# EAGLE design mapleCUx_large_320-002 (EAGLE 7.6.0)
MAPLE-CUx Large Version
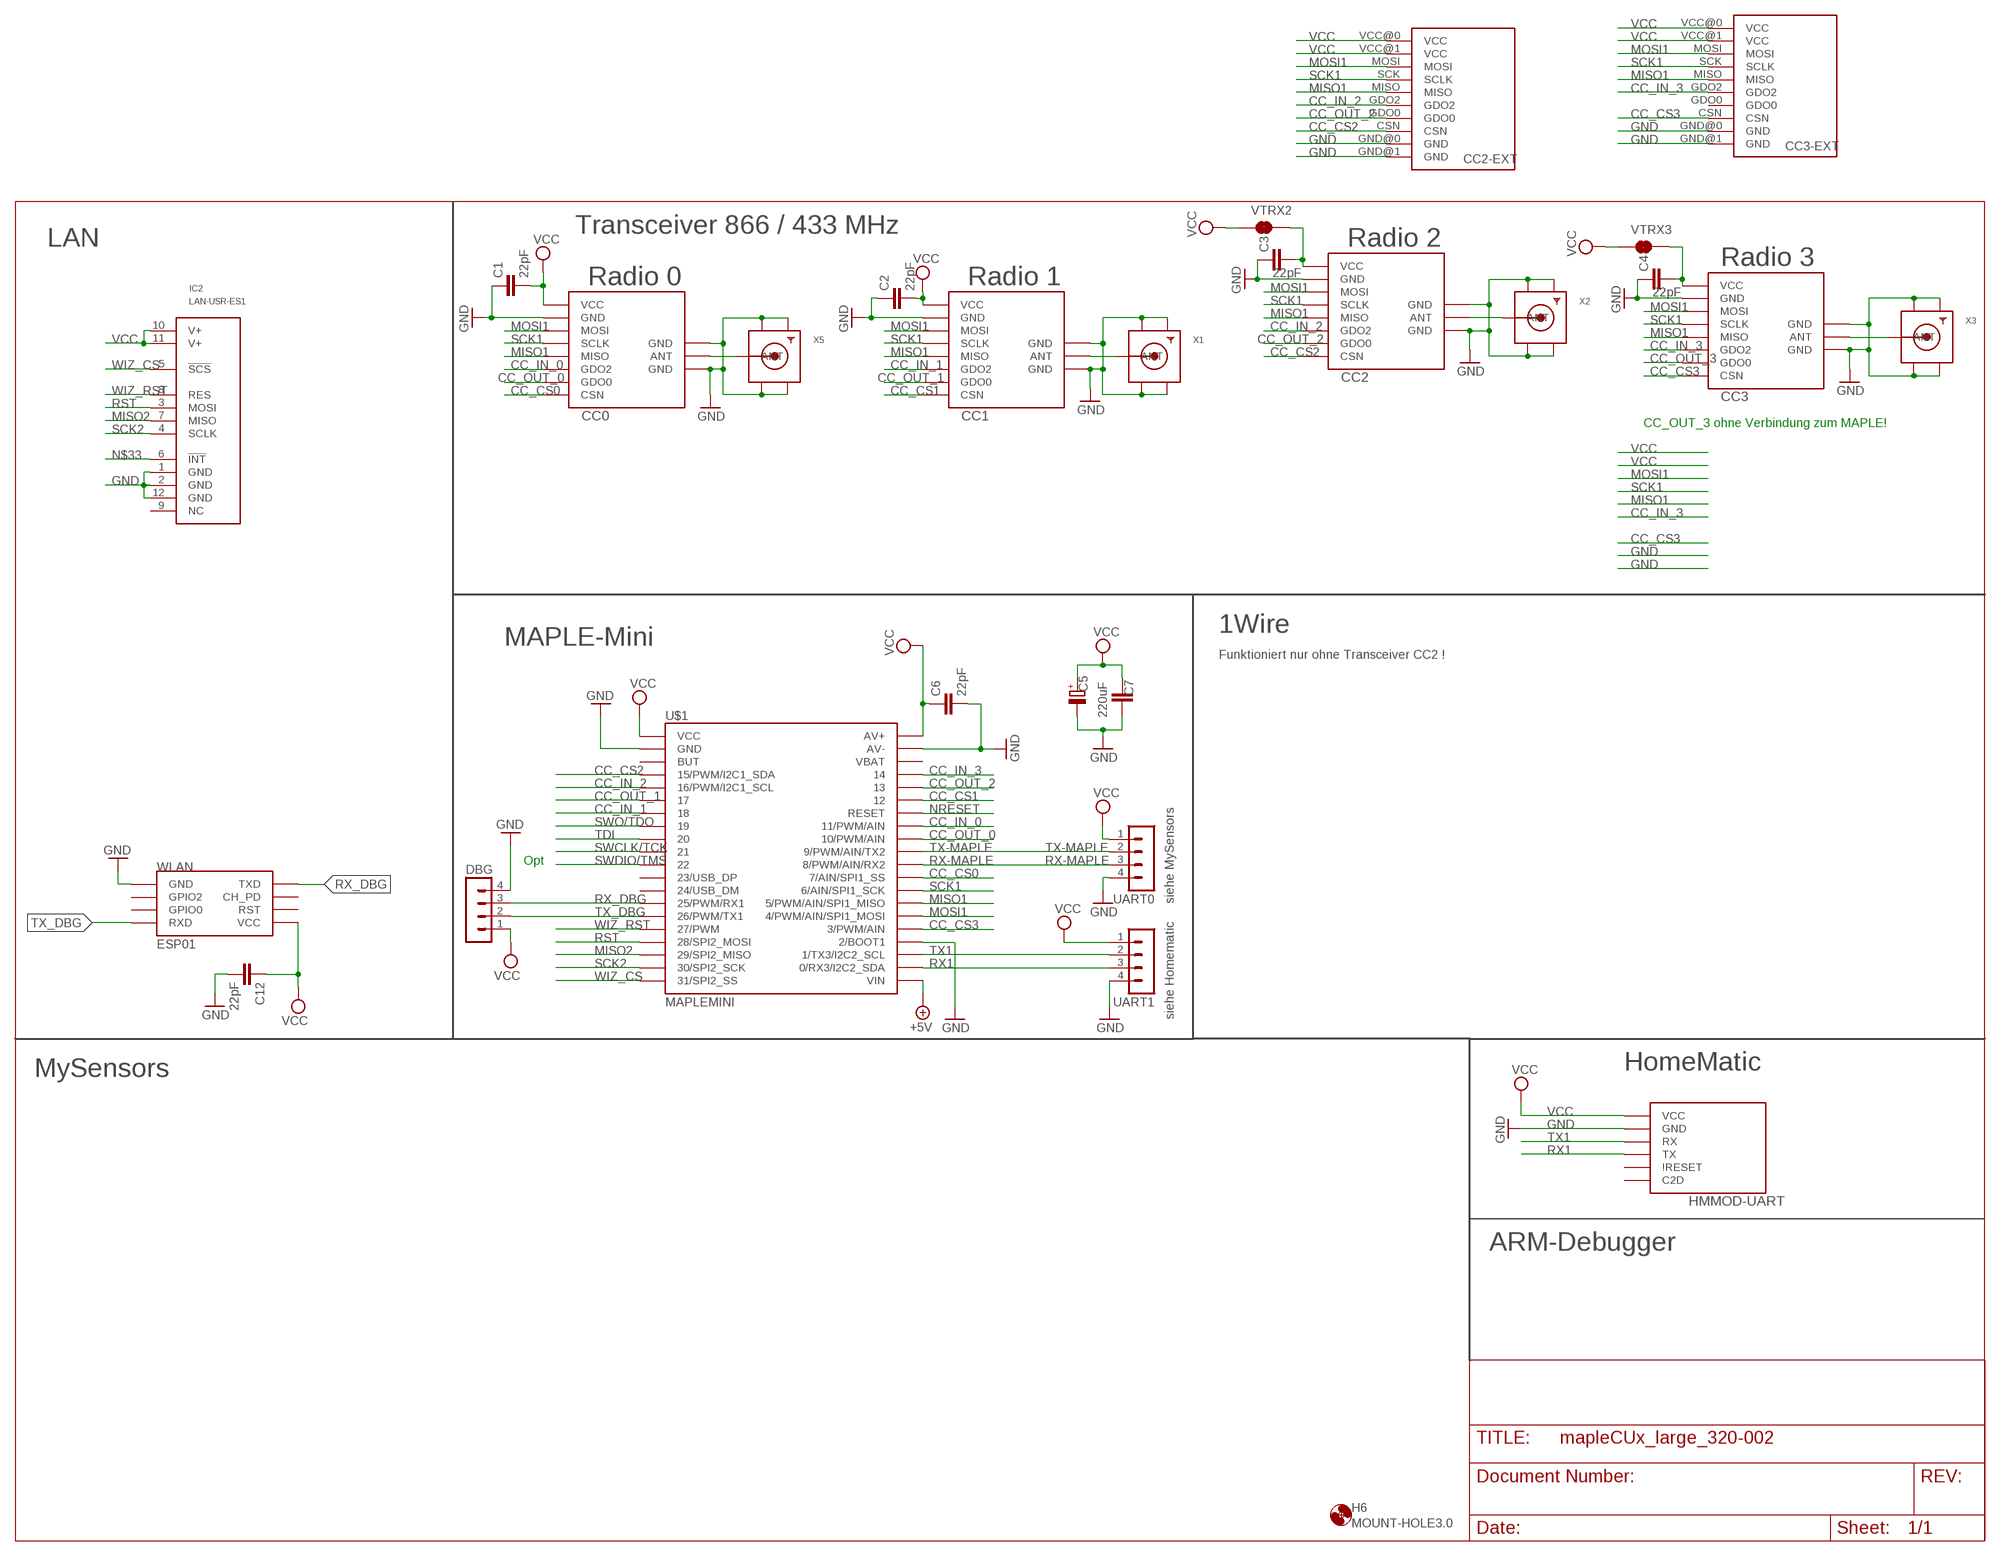
[diagram p0: schematic, sheet 1]

## Parts
C1  22pF  C-EUC0805  [C0805]
C2  22pF  C-EUC0805  [C0805]
C3  22pF  C-EUC0805  [C0805]
C4  22pF  C-EUC0805  [C0805]
C5  220uF  CPOL-EUE5-8.5  [E5-8,5]
C6  22pF  C-EUC0805  [C0805]
C7  C-EUC1812  [C1812]
C12  22pF  C-EUC0805  [C0805]
CC0  CC1101  CC1101_MODULE1SMD  [CC1101_MODULE1_SMD]
CC1  CC1101_MODULE1SMD  [CC1101_MODULE1_SMD]
CC2  CC1101_MODULE1SMD  [CC1101_MODULE1_SMD]
CC2-EXT  CC1101_MODULE3_DIL  [CC1101_MODULE3_DIL]
CC3  CC1101_MODULE1SMD  [CC1101_MODULE1_SMD]
CC3-EXT  CC1101_MODULE3_DIL  [CC1101_MODULE3_DIL]
DBG  MA04-1  [MA04-1]
H6  MOUNT-HOLE3.0  [3,0]
HMMOD-UART  HM-MOD-UARTDIL  [HM-MOD-UART-DIL]
IC2  LAN-USR-ES1  [USR-ES1]
U$1  MAPLEMINI  [20-DIP]
UART0  MA04-1  [MA04-1]
UART1  MA04-1  [MA04-1]
VTRX2  JUMPER-SMT_2_NC_TRACE_SILK  [SMT-JUMPER_2_NC_TRACE_SILK]
VTRX3  JUMPER-SMT_2_NC_TRACE_SILK  [SMT-JUMPER_2_NC_TRACE_SILK]
WLAN  ESP01  [ESP01]
X1  SMACONNECTOR_EDGE  [SMA_EDGELAUNCH]
X2  SMACONNECTOR_EDGE  [SMA_EDGELAUNCH]
X3  SMACONNECTOR_EDGE  [SMA_EDGELAUNCH]
X5  SMACONNECTOR_EDGE  [SMA_EDGELAUNCH]

## Nets
+5V [PWR]: U$1.21(VIN)
ANT0: CC0.ANT X5.P(ANT)
ANT1: CC1.ANT X1.P(ANT)
ANT2: CC2.ANT X2.P(ANT)
ANT3: CC3.ANT X3.P(ANT)
CC_CS0: CC0.CSN U$1.29(7/AIN/SPI1_SS)
CC_CS1: CC1.CSN U$1.35
CC_CS2: CC2-EXT.CSN CC2.CSN U$1.4(15/PWM/I2C1_SDA)
CC_CS3: CC3-EXT.CSN CC3.CSN U$1.25(3/PWM/AIN)
CC_IN_0: CC0.GDO2 U$1.33(11/PWM/AIN)
CC_IN_1: CC1.GDO2 U$1.7
CC_IN_2: CC2-EXT.GDO2 CC2.GDO2 U$1.5(16/PWM/I2C1_SCL)
CC_IN_3: CC3-EXT.GDO2 CC3.GDO2 U$1.37
CC_OUT_0: CC0.GDO0 U$1.32(10/PWM/AIN)
CC_OUT_1: CC1.GDO0 U$1.6
CC_OUT_2: CC2-EXT.GDO0 CC2.GDO0 U$1.36
CC_OUT_3: CC3.GDO0
GND [PWR]: C1.1 C2.1 C3.1 C4.1 C5.- C6.2 C7.1 C12.2 CC0.GND@0(GND) CC0.GND@1(GND) CC0.GND@2(GND) CC1.GND@0(GND) CC1.GND@1(GND) CC1.GND@2(GND) CC2-EXT.GND@0(GND) CC2-EXT.GND@1(GND) CC2.GND@0(GND) CC2.GND@1(GND) CC2.GND@2(GND) CC3-EXT.GND@0(GND) CC3-EXT.GND@1(GND) CC3.GND@0(GND) CC3.GND@1(GND) CC3.GND@2(GND) DBG.4 HMMOD-UART.2(GND) IC2.1(GND) IC2.2(GND) IC2.12(GND) U$1.2(GND) U$1.24(2/BOOT1) U$1.39(AV-) UART0.4 UART1.4 WLAN.GND X1.GND@1(GND4) X1.GND@2(GND3) X1.GND@3(GND2) X1.GND@4(GND1) X2.GND@1(GND4) X2.GND@2(GND3) X2.GND@3(GND2) X2.GND@4(GND1) X3.GND@1(GND4) X3.GND@2(GND3) X3.GND@3(GND2) X3.GND@4(GND1) X5.GND@1(GND4) X5.GND@2(GND3) X5.GND@3(GND2) X5.GND@4(GND1)
MISO1: CC0.MISO CC1.MISO CC2-EXT.MISO CC2.MISO CC3-EXT.MISO CC3.MISO U$1.27(5/PWM/AIN/SPI1_MISO)
MISO2: IC2.7(MISO) U$1.18(29/SPI2_MISO)
MOSI1: CC0.MOSI CC1.MOSI CC2-EXT.MOSI CC2.MOSI CC3-EXT.MOSI CC3.MOSI U$1.26(4/PWM/AIN/SPI1_MOSI)
N$1 [PWR]: C3.2 CC2.VCC VTRX2.2
N$3 [PWR]: C4.2 CC3.VCC VTRX3.2
N$33: IC2.6(!INT!)
NRESET: U$1.34(RESET)
RST: IC2.3(MOSI) U$1.17(28/SPI2_MOSI)
RX1: HMMOD-UART.5(TX) U$1.22(0/RX3/I2C2_SDA) UART1.3
RX-MAPLE: U$1.30(8/PWM/AIN/RX2) UART0.3
RX_DBG: DBG.3 U$1.14(25/PWM/RX1) WLAN.TX(TXD)
SCK1: CC0.SCLK CC1.SCLK CC2-EXT.SCK(SCLK) CC2.SCLK CC3-EXT.SCK(SCLK) CC3.SCLK U$1.28(6/AIN/SPI1_SCK)
SCK2: IC2.4(SCLK) U$1.19(30/SPI2_SCK)
SWCLK/TCK: U$1.10
SWDIO/TMS: U$1.11
SWO/TDO: U$1.8
TDI: U$1.9
TX1: HMMOD-UART.6(RX) U$1.23(1/TX3/I2C2_SCL) UART1.2
TX-MAPLE: U$1.31(9/PWM/AIN/TX2) UART0.2
TX_DBG: DBG.2 U$1.15(26/PWM/TX1) WLAN.RX(RXD)
VCC [PWR]: C1.2 C2.2 C5.+ C6.1 C7.2 C12.1 CC0.VCC CC1.VCC CC2-EXT.VCC@0(VCC) CC2-EXT.VCC@1(VCC) CC3-EXT.VCC@0(VCC) CC3-EXT.VCC@1(VCC) DBG.1 HMMOD-UART.1(VCC) IC2.10(V+) IC2.11(V+) U$1.1(VCC) U$1.40(AV+) UART0.1 UART1.1 VTRX2.1 VTRX3.1 WLAN.VCC
WIZ_CS: IC2.5(!SCS!) U$1.20(31/SPI2_SS)
WIZ_RST: IC2.8(RES) U$1.16(27/PWM)
Unconnected: CC3-EXT.GDO0 HMMOD-UART.3(C2D) HMMOD-UART.4(\!RESET) IC2.9(NC) U$1.3(BUT) U$1.12(23/USB_DP) U$1.13(24/USB_DM) U$1.38(VBAT) WLAN.CH_PD WLAN.GPIO0 WLAN.GPIO2 WLAN.RST

## Notes on the sheet
- Transceiver 866 / 433 MHz
- LAN | Radio 2
- Radio 3
- Radio 0 | Radio 1
- CC_OUT_3 ohne Verbindung zum MAPLE!
- 1Wire
- MAPLE-Mini
- Funktioniert nur ohne Transceiver CC2 !
- Opt
- siehe MySensors
- siehe Homematic
- MySensors | HomeMatic
- ARM-Debugger

## Library data of the parts
C1-C4 C6 C7 C12 = rcl:C-EU: CAPACITOR, European symbol
C5 = rcl:CPOL-EU: POLARIZED CAPACITOR, European symbol
CC0 CC1-CC3 = wireless:CC1101_MODULE1: CC1101 wireless module for 433/868 MHz (sold from Aliexpress). DIL version for mounting with pin header (and SMD soldering) and SMD only variant available.
CC2-EXT CC3-EXT = wireless:CC1101_MODULE3_DIL: 433 Mhz CC1101 wireless module named RF1101SE V3.1 package special has only limited silk screen on tPlace layer
DBG UART0 UART1 = con-lstb:MA04-1: PIN HEADER; OC_FARNELL: unknown; OC_NEWARK: unknown
H6 = holes:MOUNT-HOLE: MOUNTING HOLE with drill center marker
HMMOD-UART = wireless:HM-MOD-UART: eQ3 HM-MOD-UART-AW-SH2 wireless module for 868 MHz. DIL version for mounting with pin header (antenna upwards) and SMD variant available (antenna downwards).
IC2 = Martin-Communication:LAN-USR-ES1
U$1 = maplemini-small:MAPLEMINI
VTRX2 VTRX3 = SparkFun-Jumpers:JUMPER-SMT_2_NC_TRACE: Normally closed trace jumper This jumper has a trace between two pads so it's normally closed (NC). Use a razor knife to open the connection. For best results follow the IPC guidelines for cutting traces: Cutout at least 0.063 mm (0.005 in). Remove all loose material to clean up the cut area. Seal the cut with an approved epoxy. Reapply solder to reclose the connection.
WLAN = esp8266modules:ESP01: ESP8266 Wifi module 01
X1-X3 X5 = adafruit:SMACONNECTOR: SMA Connector 90° DIP SMA Connector, 50 Ohm (4UConnector: 07259)

## Net classes
0 default: width 0.305 mm
1 PWR: width 0.457 mm

## Board
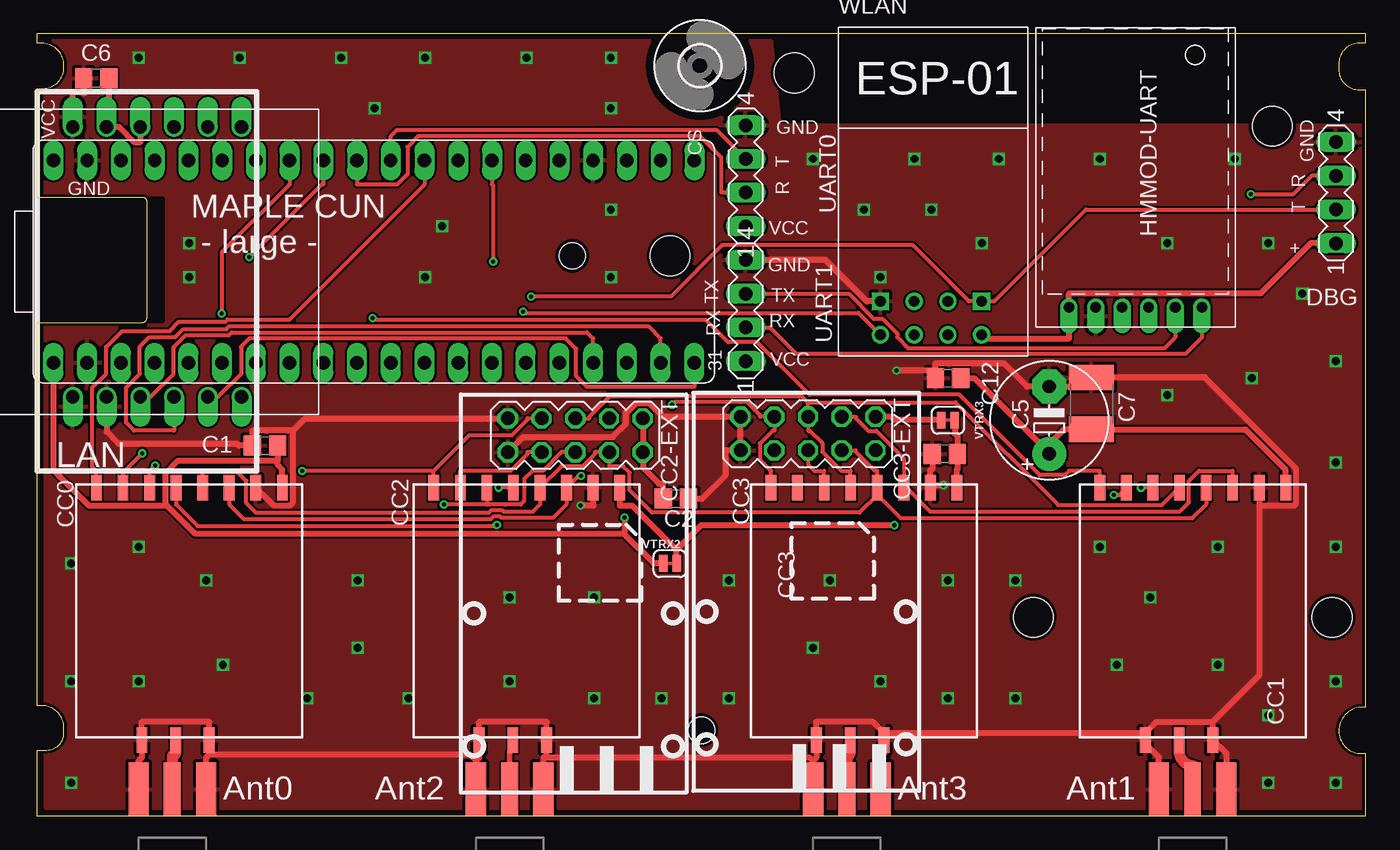
[diagram p1: board, top side]
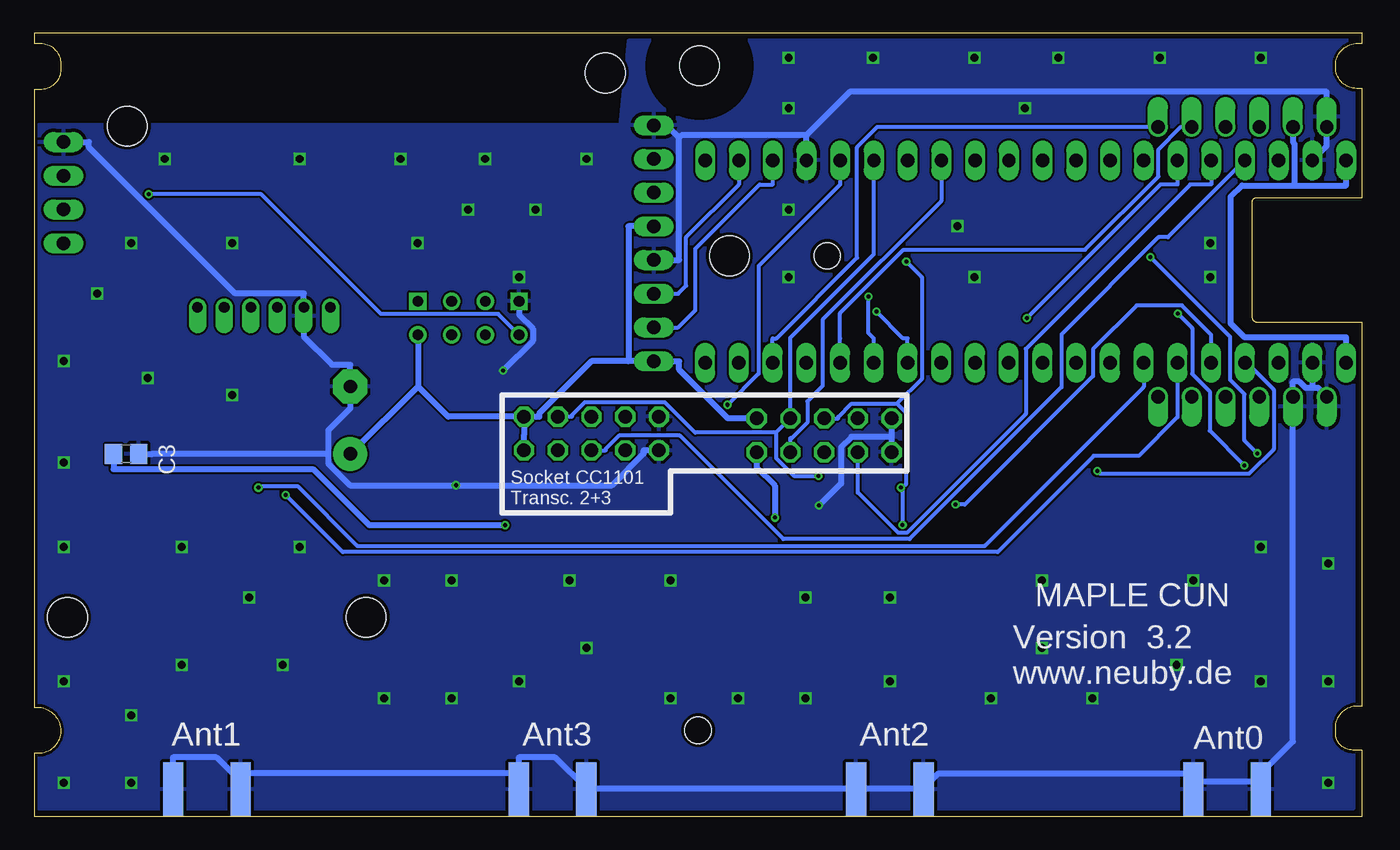
[diagram p2: board, bottom side, seen from below]

Size 100 x 59 mm. Coordinates in mm from the lower left corner, seen from the top.
Outline: 0,0 0,5 0.71,5 arc90 2,6.29 2,6.67 arc90 0.32,8.35 0,8.35 0,37.21 7.89,37.21 arc90 8.26,37.58 8.26,46.32 arc90 7.97,46.61 0,46.61 0,54.83 0.39,54.83 arc90 2,56.44 2,56.57 arc90 0.33,58.24 0,58.24 0,59 100,59 100,58.24 99.54,58.24 arc90 98,56.7 98,56.41 arc90 99.41,54.75 100,54.75 100,8.24 99.8,8.24 arc90 98,6.44 arc90 99.69,4.75 100,4.75 100,0 0,0
Copper layers (1*16): Top 0.035mm / dielectric 1.5mm / Bottom 0.035mm
Design rules "SeeedStudio_2layer_DRU_no_angle_20140221": minimum track width 6mil, minimum drill 12mil, track to track 6mil, track to pad 6mil, pad to pad 6mil, via to via 6mil, smd to smd 0mil, copper to edge 10mil, drill to drill 10mil, minimum pad ring 10mil, minimum via ring 6mil, stop-mask expansion 2mil, vias tented up to drill 100mil, thermal gap 10mil
Holes 2 mm at 50,6.5 40.28,42.23
Holes 3 mm at 47.65,42.23 93,52 57,56 75,15 97.5,15
tRestrict: area 0,37.3 to 9.4,46.5
bRestrict: area 0,37.3 to 9.4,46.5

### Footprints (pad centres in the part's own frame; a part is rotated, then mirrored left to right if it is on the bottom)
C0805 = smd 1.3 x 1.5: 1 -0.95,0; 2 0.95,0
E5-8,5 = drill 1.016 pad 2.54: + -2.54,0 | drill 1.016 pad 2.54 octagon: - 2.54,0
C1812 = smd 1.9 x 3.4: 1 -1.95,0; 2 1.95,0
CC1101_MODULE1_SMD = smd 1.93 x 0.813: ANT 19,5.96; CSN 0,0; GDO0 0,2; GDO2 0,4; GND@0 0,12; GND@1 19,8.5; GND@2 19,3.42; MISO 0,6; MOSI 0,10; SCLK 0,8; VCC 0,14
CC1101_MODULE3_DIL = drill 1.016 octagon: CSN 1.81,6.1; GDO0 4.35,6.1; GDO2 4.35,8.64; GND@0 1.81,3.56; GND@1 4.35,3.56; MISO 1.81,8.64; MOSI 1.81,11.18; SCK 4.35,11.18; VCC@0 1.81,13.72; VCC@1 4.35,13.72
MA04-1 = drill 1.016 long: 1 -3.81,0; 2 -1.27,0; 3 1.27,0; 4 3.81,0
3,0 = hole 3: 0,0
HM-MOD-UART-DIL = drill 0.8 offset: 1 0,12; 2 0,10; 3 0,8; 4 0,6; 5 0,4; 6 0,2
USR-ES1 = drill 1 pad 1.35 offset: 1 -10.16,5.715; 2 -10.16,3.175; 3 -10.16,0.635; 4 -10.16,-1.905; 5 -10.16,-4.445; 6 -10.16,-6.985; 7 10.16,-6.985; 8 10.16,-4.445; 9 10.16,-1.905; 10 10.16,0.635; 11 10.16,3.175; 12 10.16,5.715
20-DIP = drill 1.016 pad 1.27 long: 1 -24.13,-7.62; 2 -21.59,-7.62; 3 -19.05,-7.62; 4 -16.51,-7.62; 5 -13.97,-7.62; 6 -11.43,-7.62; 7 -8.89,-7.62; 8 -6.35,-7.62; 9 -3.81,-7.62; 10 -1.27,-7.62; 11 1.27,-7.62; 12 3.81,-7.62; 13 6.35,-7.62; 14 8.89,-7.62; 15 11.43,-7.62; 16 13.97,-7.62; 17 16.51,-7.62; 18 19.05,-7.62; 19 21.59,-7.62; 20 24.13,-7.62 | drill 1 pad 1.27 long: 21 24.13,7.62; 22 21.59,7.62; 23 19.05,7.62; 24 16.51,7.62; 25 13.97,7.62; 26 11.43,7.62; 27 8.89,7.62; 28 6.35,7.62; 29 3.81,7.62; 30 1.27,7.62; 31 -1.27,7.62; 32 -3.81,7.62; 33 -6.35,7.62; 34 -8.89,7.62; 35 -11.43,7.62; 36 -13.97,7.62; 37 -16.51,7.62; 38 -19.05,7.62; 39 -21.59,7.62; 40 -24.13,7.62
SMT-JUMPER_2_NC_TRACE_SILK = smd 0.635 x 1.27: 1 -0.508,0; 2 0.508,0
ESP01 = drill 0.8: CH_PD -1.285,-8.178; GPIO0 1.255,-5.638; GPIO2 -1.285,-5.638; RST 1.255,-8.178; TX -3.825,-8.178; VCC 3.795,-8.178 | drill 0.8 square: GND -3.825,-5.638; RX 3.795,-5.638
SMA_EDGELAUNCH = smd 4.064 x 1.524: GND@1 2.032,-2.54; GND@2 2.032,2.54 | smd 4.064 x 1.524 bottom: GND@3 2.032,2.54; GND@4 2.032,-2.54 | smd 4.064 x 1.27: P 2.032,0

### Placement (x,y rotation side)
C1  17.14,27.94 0 top
C2  48.08,23.95 180 top
C3  93.08,27.3 180 bottom
C4  68.33,27.3 0 top
C5  76.2,29.84 90 top
C6  4.45,55.61 180 top
C7  79.38,31.11 270 top
C12  68.58,33.02 180 top
CC0  4.45,24.77 270 top
CC1  80.01,24.77 270 top
CC2  29.84,24.77 270 top
CC2-EXT  31.87,31.79 270 top
CC3  55.24,24.77 270 top
CC3-EXT  49.4,31.93 270 top
DBG  97.79,46.99 90 top
H6  49.89,56.55 0 top
HMMOD-UART  89.69,38.35 90 top
IC2  8.38,41.78 90 top
U$1  25.34,41.8 0 top
UART0  53.34,48.26 90 top
UART1  53.34,38.1 90 top
VTRX2  47.62,19.05 0 top
VTRX3  68.58,29.84 0 top
WLAN  67.31,44.45 0 top
X1  87,0 90 top
X2  35.56,0 90 top
X3  60.96,0 90 top
X5  10.16,0 90 top

### Tracks (layer width: path | path; a pad name or v marks a point on that pad's centre or on a via)
ANT0
  Top 0.813: CC0.ANT 10.4,4.82 arc-90 10.16,4.57 X5.P
ANT1
  Top 0.813: CC1.ANT 85.97,4.96 arc90 87.12,3.81 87.12,1.02 87.12,1.91 arc90 X1.P
ANT2
  Top 0.406: CC2.ANT 35.81,5.76 35.81,5.08 35.56,4.83 X2.P | X2.P 35.56,1.27 X2.P
ANT3
  Top 0.813: CC3.ANT 61.2,4.82 arc-90 60.96,4.57 X3.P
CC_CS0
  Top 0.305: CC0.CSN 4.45,26.04 4.14,26.34 4.14,32.3 5.18,33.34 5.18,35.36 6.38,36.56 9.96,36.56 10.66,37.27 14.14,37.27 14.32,37.44 18.98,37.44 29.15,47.61 U$1.29
CC_CS1  (via drill 0.3 pad 0.61)
  Top 0.305: v25.25,37.54 25.4,37.39 50.34,37.39 52.01,35.72 54.2,35.72 58.15,31.78 69.42,31.78 75.48,25.72 77.38,25.72 77.7,26.04 80.01,26.04 CC1.CSN
  Bottom 0.305: v25.25,37.54 15.19,47.61 13.91,47.61 U$1.35
CC_CS2  (via drill 0.3 pad 0.61)
  Top 0.305: 29.84,26.04 v19.95,26.04 | CC2-EXT.CSN 36.9,29.98 36.9,29.9 35.71,28.71 32.52,28.71 29.84,26.04 | CC2.CSN 29.84,26.04
  Bottom 0.305: U$1.4 8.69,34.18 6.67,32.15 6.67,27.66 8.53,25.8 19.71,25.8 v19.95,26.04
CC_CS3  (via drill 0.3 pad 0.61)
  Top 0.305: v47.79,31.01 47.99,31.21 53.44,31.21 54.43,30.23 54.43,30.11 CC3-EXT.CSN 55.49,29.05 55.36,29.05 54.41,28.1 54.41,26.87 55.24,26.04 CC3.CSN
  Bottom 0.305: v47.79,31.01 45.45,33.35 45.45,41.46 39.31,47.61 U$1.25
CC_IN_0  (via drill 0.3 pad 0.61)
  Top 0.305: U$1.33 18.99,47.61 13.89,42.51 v13.89,37.88 | v8.87,26.44 8.46,26.04 8.45,26.04 CC0.GDO2
  Bottom 0.305: v13.89,37.88 12.8,36.79 12.8,33.34 11.48,32.02 11.48,29.06 v8.87,26.44
CC_IN_1  (via drill 0.3 pad 0.61)
  Top 0.305: CC1.GDO2 v83.11,24.77
  Bottom 0.305: v83.11,24.77 83,24.88 80.16,24.88 75.67,20.39 28.41,20.39 16.45,32.35 U$1.7
CC_IN_2  (via drill 0.3 pad 0.61)
  Top 0.305: 33.84,23.5 v30.61,23.5 | 33.84,23.5 33.97,23.5 35.23,23.5 36.39,23.5 36.66,23.77 36.66,25.42 37.28,26.04 38.07,26.04 39.44,27.4 39.44,27.44 CC2-EXT.GDO2 | CC2.GDO2 33.84,23.5
  Bottom 0.305: v30.61,23.5 29.93,23.5 20.26,33.16 20.26,35.2 16.97,38.48 13.57,38.48 11.37,36.28 11.37,36.01 U$1.5
CC_IN_3
  Top 0.305: CC3.GDO2 59.24,26.04 58.51,26.04 58.03,26.51 CC3-EXT.GDO2
  Bottom 0.305: U$1.37 14.62,43.62 15.33,43.62 22.64,36.31 22.64,32.33 34.08,20.9 43.59,20.9 51.38,28.69 55.97,28.69 56.97,27.69 56.97,27.57 CC3-EXT.GDO2
CC_OUT_0  (via drill 0.3 pad 0.61)
  Top 0.305: U$1.32 21.53,47.61 21.42,47.61 v15.95,42.14 | CC0.GDO0 6.45,26.04 6.56,26.04 v7.88,27.36
  Bottom 0.305: v7.88,27.36 8.86,28.33 8.86,31.81 9.94,32.89 9.94,36.12 v15.95,42.14
CC_OUT_1  (via drill 0.3 pad 0.61)
  Top 0.305: v81.06,24.23 81.47,24.23 CC1.GDO0
  Bottom 0.305: U$1.6 13.91,30.08 16.82,27.17 20.2,27.17 27.44,19.93 76.76,19.93 v81.06,24.23
CC_OUT_2
  Top 0.305: CC2.GDO0 31.84,26.04 35.63,26.04 36.9,27.31 36.9,27.44 CC2-EXT.GDO0
  Bottom 0.305: U$1.36 11.37,47.61 12.94,47.61 25.34,35.21 25.34,30.32 34.29,21.36 34.93,21.36 37.97,24.4 CC2-EXT.GDO0
GND  (via drill 0.3 pad 0.61, 0.6)
  Top 0.457: WLAN.GND 62.45,38.81 59.35,41.91 UART1.4 | v40.89,23.42 41.84,23.42 CC2.GND@0 | 63.74,6.29 62.92,7.11 58.66,7.11 CC3.GND@2 58.66,5.09 58.66,4.42 58.42,4.17 | 63.74,6.29 83.43,6.29 | 67.63,33.59 v64.69,33.59 | 92.01,23.42 92.01,10.61 88.51,7.11 | CC1.GND@0 92.01,23.42 | 92.01,23.42 94.64,23.42 94.8,23.58 94.8,26.19 87.92,33.06 C7.1 78.53,33.06 77.85,32.38 C5.- 74.55,32.38 72.78,34.15 67.63,34.15 67.63,33.59 | 83.43,6.29 84.26,7.11 88.51,7.11 | 88.51,7.11 CC1.GND@1 89.53,4.74 X1.GND@4 | 83.43,6.29 CC1.GND@2 83.43,5.47 84.45,4.45 X1.GND@3 | 63.74,6.29 CC3.GND@1 63.74,4.69 63.5,4.45 X3.GND@4 | C12.2 67.63,33.59 | 12.95,4.69 CC0.GND@1 12.95,7.11 7.87,7.11 CC0.GND@2 7.87,4.42 7.62,4.17 X5.GND@3 | 67.25,24.95 67.25,26.11 67.31,26.17 67.38,26.17 C4.1 | CC3.GND@0 67.25,24.95 | v68.25,24.95 67.25,24.95 | 38.34,4.45 CC2.GND@1 38.34,7.11 33.27,7.11 CC2.GND@2 33.27,4.42 33.02,4.17 | 38.34,4.45 38.1,4.45 X2.GND@1 | 38.34,4.45 58.15,4.45 58.42,4.17 | 58.42,4.17 X3.GND@3 | 12.95,4.69 12.7,4.45 X5.GND@4 | 12.95,4.69 32.5,4.69 33.02,4.17 | 33.02,4.17 X2.GND@3 | CC2-EXT.GND@1 36.57,28.58 43.33,28.58 44.32,29.57 44.32,30.39 45.06,31.14 46.08,31.14 47.1,30.11 CC3-EXT.GND@0 CC3-EXT.GND@1 51.81,27.57 51.81,25.7 50.06,23.95 C2.1 | IC2.12 2.67,54.59 3.39,54.59 3.5,54.48 C6.2 | 19.25,29.07 20.16,29.98 CC2-EXT.GND@0 | IC2.2 5.21,28.98 6.12,28.07 15.03,28.07 15.16,27.94 C1.1 16.2,29.07 19.25,29.07 | CC0.GND@0 17.79,23.42 19.01,23.42 19.25,23.66 19.25,29.07
  Bottom 0.457: DBG.4 95.89,50.8 95.89,50.41 84.86,39.39 79.69,39.39 HMMOD-UART.2 79.69,36.16 77.57,34.04 76.2,34.04 C5.- 76.2,30.73 77.86,29.07 77.86,27.3 | 77.86,27.3 77.86,26.6 76.21,24.95 v68.25,24.95 56.48,24.95 54.1,27.34 54.1,27.57 CC3-EXT.GND@1 | 77.86,27.3 91.09,27.3 C3.1 | UART1.4 51.44,41.91 51.44,51.12 | 51.44,51.12 52.39,52.07 UART0.4 | 41.85,51.31 51.24,51.31 51.44,51.12 | 35.43,28.6 CC2-EXT.GND@1 | CC2-EXT.GND@0 35.43,28.6 | 35.43,28.6 38.46,28.6 39.24,27.82 39.24,25.07 v40.89,23.42 | 3.75,32.27 4.25,32.27 4.74,32.76 5.21,32.76 IC2.2 5.21,5.65 7.62,3.24 7.62,2.63 | IC2.1 3.32,32.27 3.75,32.27 | U$1.2 3.75,32.27 | v64.69,33.59 62.45,35.83 62.45,36.74 63.48,37.78 WLAN.GND | 12.7,2.63 12.7,3.24 31.89,3.24 33.02,2.11 | X5.GND@4 12.7,2.63 | X5.GND@3 7.62,2.63 | 12.7,2.63 7.62,2.63 | X1.GND@4 89.53,4.45 86.27,4.45 84.45,2.63 | 84.45,2.63 X1.GND@3 | 63.5,3.24 83.85,3.24 84.45,2.63 | 63.5,3.24 63.5,4.45 60.76,4.45 58.42,2.11 | X3.GND@4 63.5,3.24 | X2.GND@3 33.02,2.11 | 38.1,2.11 33.02,2.11 | X2.GND@1 38.1,2.11 | 58.42,2.11 38.1,2.11 | X3.GND@3 58.42,2.11 | 41.85,51.31 38.57,54.59 2.67,54.59 IC2.12 2.67,50.5 U$1.39 | U$1.24 41.85,51.31
  other vias: 7.62,57.15 15.24,57.15 22.86,57.15 29.21,57.15 67.31,45.72 36.83,57.15 43.18,57.15 43.18,53.34 43.18,45.72 43.18,40.64 58.42,49.53 66.04,49.53 72.39,49.53 80.01,49.53 90.17,49.53 85.09,43.18 63.5,40.64 71.12,43.18 92.71,43.18 95.25,39.37 97.79,34.29 91.44,33.02 97.79,26.67 97.79,20.32 97.79,10.16 97.79,2.54 92.71,2.54 92.71,7.62 88.9,11.43 80.01,20.32 88.9,20.32 81.28,11.43 83.82,16.51 73.66,8.89 73.66,17.78 68.58,17.78 68.58,8.89 52.07,8.89 52.07,17.78 58.42,12.7 46.99,8.89 41.91,16.51 35.56,16.51 35.56,10.16 41.91,8.89 27.94,8.89 24.13,17.78 20.32,8.89 13.97,11.43 12.7,17.78 7.62,20.32 7.62,10.16 2.54,2.54 2.54,10.16 2.54,19.05 11.43,43.18 11.43,40.64 30.48,44.45 29.21,40.64 25.4,53.34 85.09,31.75 62.23,45.72 63.5,10.16 59.69,17.78 24.13,12.7
  pour Bottom: 0.64,0.64 0.64,58.42 55.24,58.42 55.88,52.07 99.69,52.07 99.69,0.64
  pour Top: 0.64,0.64 0.64,58.42 55.24,58.42 55.88,52.07 99.69,52.07 99.69,0.64
MISO1  (via drill 0.3 pad 0.61)
  Top 0.305: U$1.27 34.23,47.61 34.33,47.5 v34.33,41.79 | v34.6,21.97 34.5,21.88 12.06,21.88 10.45,23.5 CC0.MISO | 58.03,31.18 69.14,31.18 76.87,23.45 84.69,23.45 CC1.MISO | 58.03,31.18 57.55,31.67 43.13,31.67 41.58,30.11 41.58,29.98 CC2-EXT.MISO | 58.03,31.18 CC3-EXT.MISO 58.03,29.58 58.03,29.05 58.17,29.05 59.1,28.11 59.1,27.47 60.53,26.04 61.24,26.04 CC3.MISO | CC2.MISO v34.72,24.77
  Bottom 0.305: 35.03,31.09 34.36,30.42 34.36,25.01 34.6,24.77 | 35.03,31.09 38.45,31.09 39.44,30.09 39.44,29.98 CC2-EXT.MISO | v34.33,41.79 33.16,40.61 33.16,32.96 35.03,31.09 | 34.6,24.77 v34.6,21.97 | 34.6,24.77 v34.72,24.77
MISO2
  Bottom 0.305: U$1.18 44.39,36.01 44.11,36.01 38.04,42.08 38.04,50.41 36.5,51.94 IC2.7
MOSI1  (via drill 0.3 pad 0.61)
  Top 0.305: CC1.MOSI 90.01,26.04 87.47,26.04 86.72,25.29 86.72,23.67 86.04,22.99 67.22,22.99 65.25,24.96 65.25,25.01 | 65.25,25.01 CC3.MOSI | 65.25,25.01 65.25,26.98 63.17,29.05 62.58,29.05 61.64,29.98 61.64,30.11 CC3-EXT.MOSI | v40.95,25.66 40.73,25.66 CC2.MOSI 39.84,23.5 38.84,22.49 34.94,22.49 34.85,22.58 34.35,22.58 34.15,22.38 15.56,22.38 14.45,23.5 CC0.MOSI
  Bottom 0.305: 44.12,28.91 50.23,28.91 52.51,31.19 58.55,31.19 59.51,30.23 59.51,30.11 CC3-EXT.MOSI | 44.12,28.91 CC2-EXT.MOSI 43.05,36.07 36.77,42.36 U$1.26 | 44.12,28.91 44.12,27 42.78,25.66 v40.95,25.66
N$1  (via drill 0.3 pad 0.61)
  Top 0.457: 48.13,20.07 50.01,21.94 v64.56,21.94 | VTRX2.2 48.13,20.07 | CC2.VCC 43.84,23.42 44.78,23.42 48.13,20.07
  Bottom 0.457: v64.56,21.94 74.78,21.94 79.01,26.17 94.03,26.17 C3.2
N$3
  Top 0.457: CC3.VCC 69.25,26.11 69.28,26.15 C4.2 69.28,28.63 69.09,28.83 VTRX3.2
RST
  Top 0.305: IC2.3 8.54,31.62 10.26,33.34 10.26,35.34 11.17,36.25 14.42,36.25 14.63,36.47 41.39,36.47 41.85,36.01 U$1.17
RX1
  Top 0.305: HMMOD-UART.5 85.69,36.09 84.91,35.3 65.56,35.3 64.75,36.1 64.75,36.37 63.62,37.5 62.97,37.5 61.1,39.37 UART1.3
  Bottom 0.305: U$1.22 46.93,47.61 50.9,43.63 50.9,39.98 51.51,39.37 UART1.3
RX-MAPLE
  Top 0.305: U$1.30 26.61,51.23 27.06,51.69 51.18,51.69 UART0.3
RX_DBG  (via drill 0.3 pad 0.61)
  Top 0.305: DBG.3 95.96,48.26 94.58,46.87 v91.38,46.87 | v36.58,38.03 36.68,37.92 61.83,37.92 WLAN.TX
  Bottom 0.305: WLAN.TX 65.07,37.85 73.89,37.85 82.91,46.87 v91.38,46.87 | U$1.14 34.23,36.01 34.56,36.01 v36.58,38.03
SCK1
  Top 0.305: 63.24,24.23 65,22.47 86.99,22.47 88.01,23.5 CC1.SCLK | 63.24,24.23 61.91,22.89 46.29,22.89 44.59,24.59 44.59,25.9 44.12,26.37 43.05,26.37 CC2-EXT.SCK 41.98,27.44 41.98,27.31 41.05,26.37 39.45,26.37 CC2.SCLK 37.84,23.5 37.3,22.95 35.13,22.95 35.04,23.04 34.16,23.04 33.99,22.87 16.47,22.87 15.73,23.61 15.73,25.29 14.99,26.04 12.45,26.04 CC0.SCLK | 63.24,24.23 CC3.SCLK 63.24,26.04 63.07,26.04 61.64,27.46 61.64,27.57 CC3-EXT.SCK
  Bottom 0.305: CC2-EXT.SCK 43.05,28.51 42.94,28.51 41.78,29.67 41.78,31.27 40.62,32.42 40.62,37.43 31.69,46.37 U$1.28
SCK2
  Top 0.305: IC2.4 10.29,29.06 7.28,29.06 6.68,29.66 6.68,32.3 7.72,33.34 7.72,35.39 8.44,36.11 10.37,36.11 10.98,36.71 14.23,36.71 14.44,36.92 46.01,36.92 46.93,36.01 U$1.19
TX1
  Top 0.305: HMMOD-UART.6 87.69,36.09 86.45,34.84 57.16,34.84 55.17,36.83 UART1.2
  Bottom 0.305: U$1.23 44.39,47.61 45.37,47.61 50.21,42.76 50.21,38.13 51.51,36.83 UART1.2
TX-MAPLE
  Top 0.305: U$1.31 24.07,47.61 27.1,47.61 27.88,48.38 27.88,50.43 28.68,51.23 49.91,51.23 51.51,49.63 51.51,46.99 UART0.2
TX_DBG  (via drill 0.3 pad 0.61)
  Top 0.305: v37.19,39.16 47.7,39.16 51.56,43.03 65.93,43.03 70.15,38.81 WLAN.RX 72.06,38.81 78.97,45.72 DBG.2 | v37.19,39.16
  Bottom 0.305: v37.19,39.16 37.19,36.43 36.77,36.01 U$1.15
VCC  (via drill 0.3 pad 0.61)
  Top 0.457: 9.66,23.51 9.66,25.89 10.58,26.81 18.09,26.81 | 44.22,21.29 11.88,21.29 9.66,23.51 | U$1.1 1.21,26.08 3.87,23.42 9.56,23.42 9.66,23.51 | 44.22,21.29 44.22,21.25 46.42,19.05 VTRX2.1 | v44.22,22.51 44.22,21.29 | 76.2,28.1 76.23,28.1 77.29,29.16 C7.2 90.96,29.16 94.01,26.11 CC1.VCC | 76.2,28.1 75.48,28.1 70.56,33.02 C12.1 | C5.+ 76.2,28.1 | C2.2 47.12,25.08 46.81,25.08 45.59,26.3 CC2-EXT.VCC@1 CC2-EXT.VCC@0 | CC0.VCC 18.45,26.11 18.09,26.46 18.09,26.81 | C1.2 18.09,26.81 | 5.39,51.94 6.14,51.94 7.28,50.81 7.75,50.81 IC2.10 | IC2.11 5.39,51.94 | 5.39,51.94 C6.1 | CC3-EXT.VCC@0 64.26,30.11 64.53,29.84 VTRX3.1 | DBG.1 95.89,43.18 92.09,39.39 77.69,39.39 HMMOD-UART.1 77.69,36.01 71.37,36.01 WLAN.VCC
  Bottom 0.457: 71.11,32.4 C5.+ | WLAN.VCC 71.11,32.4 | CC3-EXT.VCC@0 68.82,30.11 71.11,32.4 | CC3-EXT.VCC@0 63.12,28.72 CC3-EXT.VCC@1 | v44.22,22.51 44.22,24.93 45.59,26.3 CC2-EXT.VCC@1 | U$1.1 1.21,36.08 8.84,36.08 9.9,37.14 9.9,46.67 9.04,47.53 5.11,47.53 | CC2-EXT.VCC@0 47.75,29.98 51.44,33.66 51.44,34.29 UART1.1 55.24,34.29 | 55.24,34.29 58.03,34.29 61.97,30.35 61.97,30.11 CC3-EXT.VCC@0 | UART0.1 55.24,44.45 55.24,34.29 | IC2.11 5.21,50.81 5.11,50.71 5.11,47.53 | 5.11,47.53 1.21,47.53 U$1.40
WIZ_CS
  Top 0.305: U$1.20 49.47,32.35 41.4,32.35 40.58,33.18 40.58,35.21 39.78,36.01 15.96,36.01 15.34,35.39 15.34,33.34 13.62,31.62 IC2.5
WIZ_RST
  Bottom 0.305: 39.31,36.01 | 39.31,36.01 39.31,37.91 34.53,42.69 20.86,42.69 15.34,48.21 15.34,50.24 13.64,51.94 IC2.8 | U$1.16 39.31,36.01

### Text on the board
tNames: CS | VCC | GND | T | GND | GND | R | R | VCC | T | + | MAPLE CUN / - large - | GND | TX | TX | RX | RX | 31 | VCC | LAN | CC3 | Ant0 | Ant2 | Ant3 | Ant1
bNames: Socket CC1101 / Transc. 2+3 | MAPLE CUN | Version 3.2 / www.neuby.de | Ant0 | Ant2 | Ant3 | Ant1